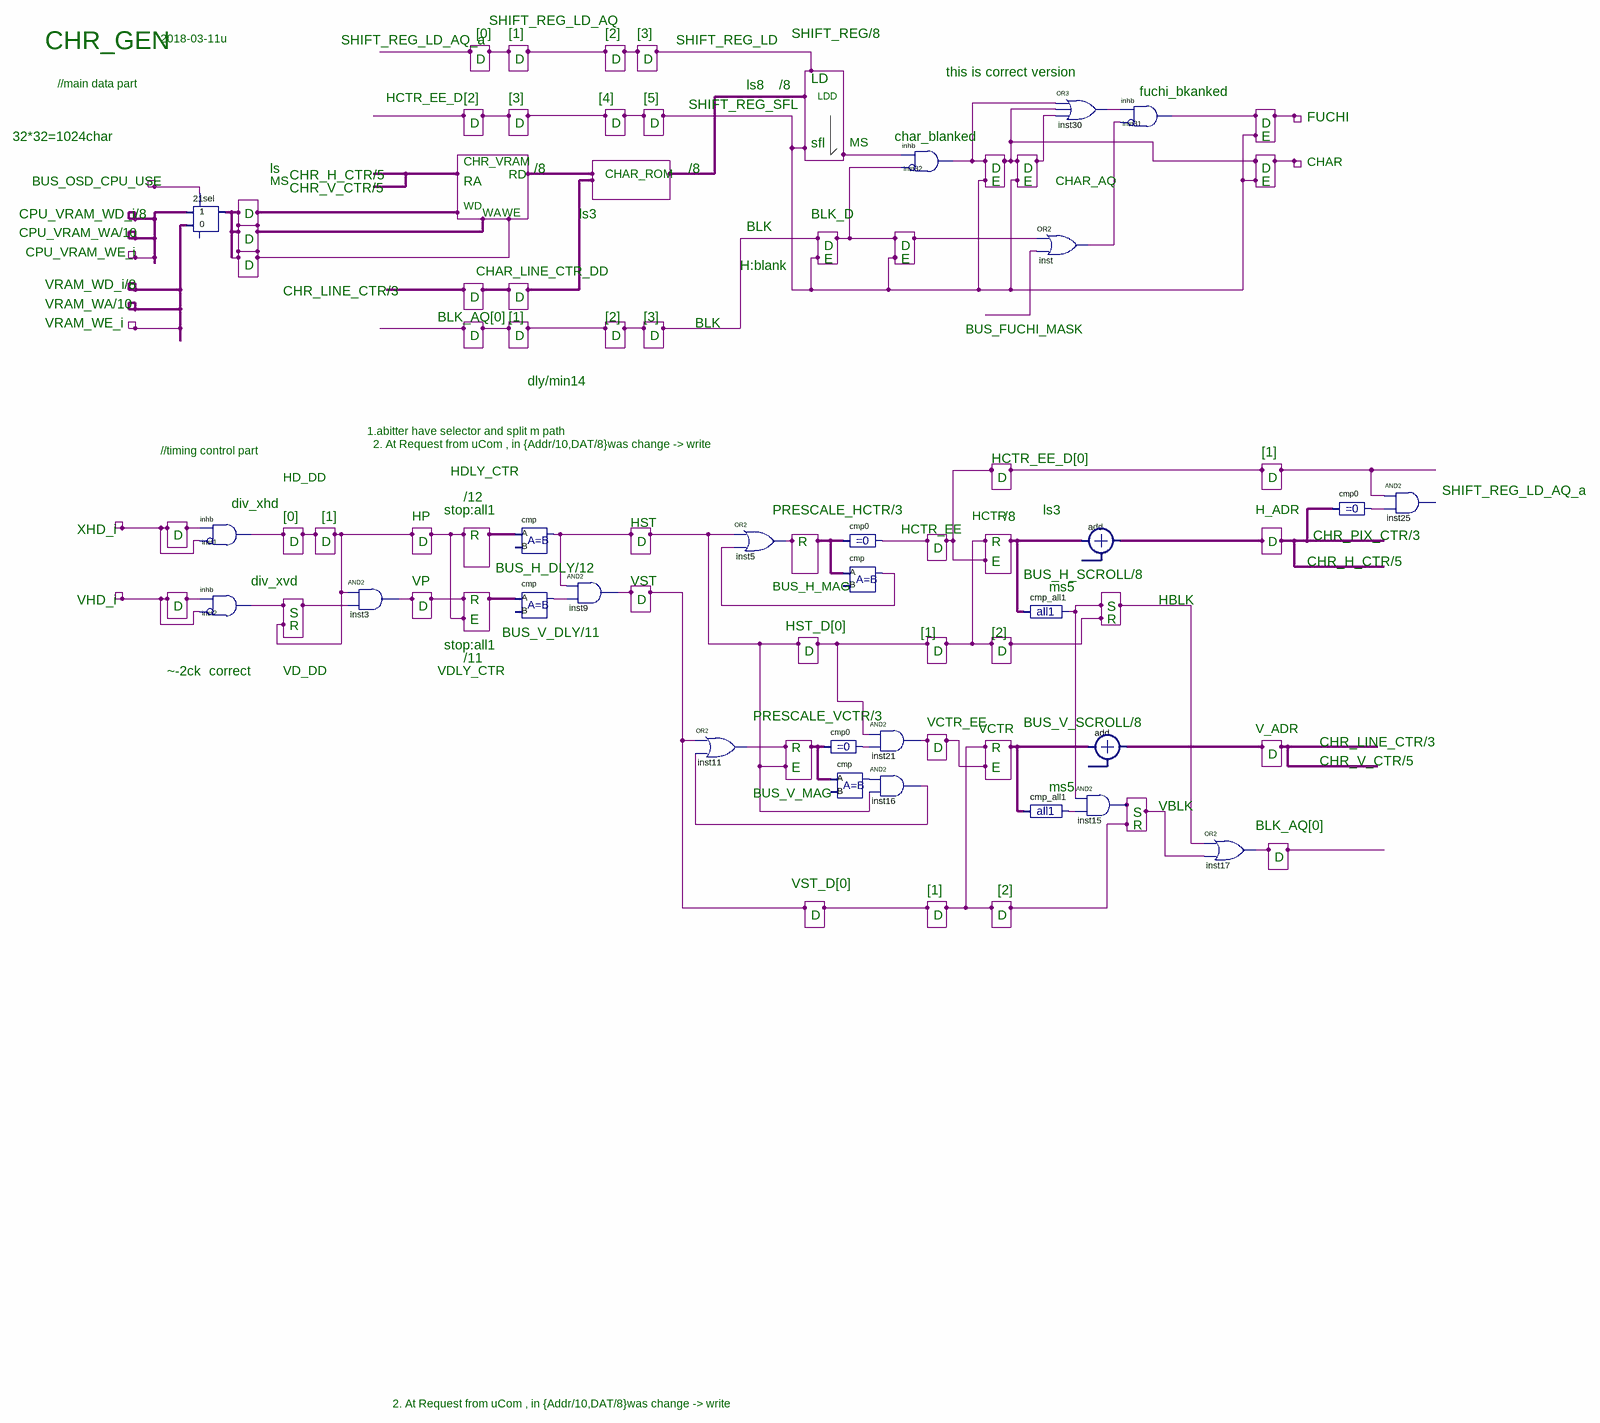
[diagram p0: schematic sheet]
// Quartus schematic CHAR_GEN.bdf as structural Verilog: 27 symbols, 0 pins
module CHAR_GEN (
);

  wire inst1_1, inst5_out, inst6_y, inst7_y, inst8_y, inst9_out, inst10_y, inst12_y, inst14_y, inst16_out,
       inst17_out, inst19_y, inst20_y, inst23_y, inst24_y, inst30_out, inst_out, undriven, undriven_2,
       undriven_3, undriven_4, undriven_5, undriven_6;

  \21sel  inst23 (.\0 (undriven_3), .\1 (undriven_4), .sel2(undriven_5), .y(inst23_y));  // open: s
  inhb inst1 (.\2 (undriven), .\3 (undriven), .\1 (inst1_1));
  inhb inst2 (.\2 (undriven_2), .\3 (undriven_2), .\1 (inst1_1));
  and inst3 (inst1_1, inst1_1, inst1_1);
  cmp inst7 (.A(inst1_1), .y(inst7_y));  // open: B
  cmp inst8 (.A(inst1_1), .y(inst8_y));  // open: B
  and inst9 (inst9_out, inst7_y, inst8_y);
  or inst11 (inst7_y, inst9_out, inst16_out);
  or inst5 (inst5_out, inst7_y, inst6_y);
  cmp0 inst4 (.A(inst5_out), .y(inst7_y));
  cmp inst6 (.A(inst5_out), .y(inst6_y));  // open: B
  cmp0 inst10 (.A(inst7_y), .y(inst10_y));
  cmp inst12 (.A(inst7_y), .y(inst12_y));  // open: B
  inhb inst32 (.\2 (inst23_y), .\3 (inst23_y), .\1 (inst23_y));
  and inst21 (inst9_out, inst7_y, inst10_y);
  and inst16 (inst16_out, inst12_y, inst7_y);
  or inst30 (inst30_out, inst23_y, inst23_y, inst23_y);
  or inst (inst_out, inst23_y, undriven_6);
  cmp_all1 inst13 (.A(inst7_y), .y(inst7_y));
  cmp_all1 inst14 (.A(inst9_out), .y(inst14_y));
  add inst19 (.A(inst7_y), .y(inst19_y));  // open: B
  add inst20 (.A(inst9_out), .y(inst20_y));  // open: B
  and inst15 (inst9_out, inst7_y, inst14_y);
  inhb inst31 (.\2 (inst30_out), .\3 (inst_out), .\1 (inst23_y));
  or inst17 (inst17_out, inst7_y, inst9_out);
  cmp0 inst24 (.A(inst19_y), .y(inst24_y));
  // AND2 inst25 has open pins: IN1=inst7_y, IN2=inst24_y, OUT=open

  // Notes on the sheet:
  //   SHIFT_REG_LD_AQ
  //   CHR_GEN
  //   [0]
  //   [1]
  //   [2]
  //   [3]
  //   SHIFT_REG/8
  //   2018-03-11u
  //   SHIFT_REG_LD_AQ_a
  //   SHIFT_REG_LD
  //   D
  //   D
  //   D
  //   D
  //   this is correct version
  //   LD
  //   //main data part
  //   ls8
  //   /8
  //   fuchi_bkanked
  //   HCTR_EE_D
  //   [2]
  //   [3]
  //   [4]
  //   [5]
  //   LDD
  //   SHIFT_REG_SFL
  //   FUCHI
  //   D
  //   D
  //   D
  //   D
  //   D
  //   32*32=1024char
  //   char_blanked
  //   E
  //   sfl
  //   MS
  //   CHR_VRAM
  //   CHAR
  //   ls
  //   /8
  //   /8
  //   D
  //   D
  //   D
  //   CHR_H_CTR/5
  //   RD
  //   CHAR_ROM
  //   BUS_OSD_CPU_USE
  //   MS
  //   RA
  //   E
  //   E
  //   CHAR_AQ
  //   E
  //   CHR_V_CTR/5
  //   WD
  //   CPU_VRAM_WD_i/8
  //   D
  //   WA
  //   WE
  //   ls3
  //   BLK_D
  //   BLK
  //   CPU_VRAM_WA/10
  //   D
  //   D
  //   D
  //   CPU_VRAM_WE_i
  //   E
  //   E
  //   D
  //   H:blank
  //   CHAR_LINE_CTR_DD
  //   VRAM_WD_i/8
  //   CHR_LINE_CTR/3
  //   D
  //   D
  //   VRAM_WA/10
  //   BLK_AQ[0]
  //   [1]
  //   [2]
  //   [3]
  //   VRAM_WE_i
  //   BLK
  //   BUS_FUCHI_MASK
  //   D
  //   D
  //   D
  //   D
  //   dly/min14
  //   1.abitter have selector and split m path
  //   2. At Request from uCom , in {Addr/10,DAT/8}was change -> write
  //   //timing control part
  //   [1]
  //   HCTR_EE_D[0]
  //   HDLY_CTR
  //   HD_DD
  //   D
  //   D
  //   SHIFT_REG_LD_AQ_a
  //   /12
  //   div_xhd
  //   stop:all1
  //   PRESCALE_HCTR/3
  //   ls3
  //   H_ADR
  //   [0]
  //   [1]
  //   HP
  //   HCTR
  //   /8
  //   HST
  //   XHD_i
  //   HCTR_EE
  //   D
  //   R
  //   CHR_PIX_CTR/3
  //   D
  //   D
  //   D
  //   D
  //   R
  //   R
  //   D
  //   D
  //   E
  //   CHR_H_CTR/5
  //   BUS_H_DLY/12
  //   BUS_H_SCROLL/8
  //   div_xvd
  //   VP
  //   VST
  //   BUS_H_MAG
  //   ms5
  //   VHD_i
  //   R
  //   D
  //   HBLK
  //   D
  //   D
  //   S
  //   S
  //   E
  //   R
  //   R
  //   HST_D[0]
  //   BUS_V_DLY/11
  //   [1]
  //   [2]
  //   stop:all1
  //   D
  //   D
  //   D
  //   /11
  //   ~-2ck  correct
  //   VD_DD
  //   VDLY_CTR
  //   PRESCALE_VCTR/3
  //   VCTR_EE
  //   BUS_V_SCROLL/8
  //   VCTR
  //   V_ADR
  //   CHR_LINE_CTR/3
  //   R
  //   D
  //   R
  //   D
  //   CHR_V_CTR/5
  //   E
  //   E
  //   ms5
  //   BUS_V_MAG
  //   VBLK
  //   S
  //   R
  //   BLK_AQ[0]
  //   D
  //   VST_D[0]
  //   [1]
  //   [2]
  //   D
  //   D
  //   D
  //   2. At Request from uCom , in {Addr/10,DAT/8}was change -> write
endmodule
